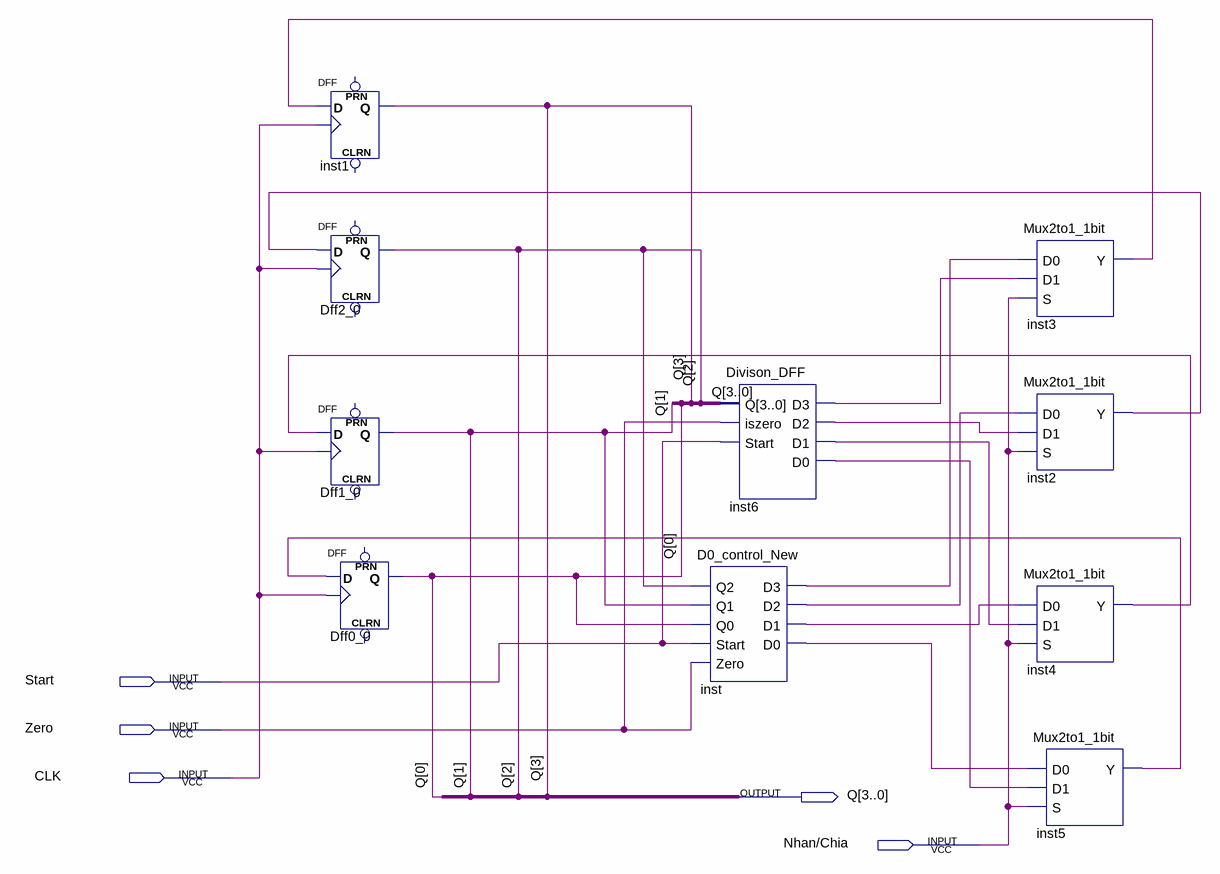
[diagram p0: schematic sheet]
// Quartus schematic Start_Zero_New.bdf as structural Verilog: 10 symbols, 5 pins
module Start_Zero_New (
  input  Start,
  input  Zero,
  input  CLK,
  input  \Nhan/Chia ,
  output [3:0] Q
);

  wire inst2_y, inst3_y, inst4_y, inst5_y, inst6_d0, inst6_d1, inst6_d2, inst6_d3, inst_d0, inst_d1, inst_d2,
       inst_d3;

  DFF inst1 (.CLK(CLK), .D(inst3_y), .Q(Q[3]));  // open: CLRN, PRN
  DFF Dff2_0 (.CLK(CLK), .D(inst2_y), .Q(Q[2]));  // open: CLRN, PRN
  DFF Dff1_0 (.CLK(CLK), .D(inst4_y), .Q(Q[1]));  // open: CLRN, PRN
  DFF Dff0_0 (.CLK(CLK), .D(inst5_y), .Q(Q[0]));  // open: CLRN, PRN
  Divison_DFF inst6 (.Q(Q), .iszero(Zero), .Start(Start), .D3(inst6_d3), .D2(inst6_d2), .D1(inst6_d1), .D0(inst6_d0));
  D0_control_New inst (
    .Q2(Q[2]), .Q1(Q[1]), .Q0(Q[0]), .Start(Start), .Zero(Zero), .D3(inst_d3), .D2(inst_d2), .D1(inst_d1),
    .D0(inst_d0));
  Mux2to1_1bit inst3 (.D0(inst_d3), .D1(inst6_d3), .S(\Nhan/Chia ), .Y(inst3_y));
  Mux2to1_1bit inst2 (.D0(inst_d2), .D1(inst6_d2), .S(\Nhan/Chia ), .Y(inst2_y));
  Mux2to1_1bit inst4 (.D0(inst_d1), .D1(inst6_d1), .S(\Nhan/Chia ), .Y(inst4_y));
  Mux2to1_1bit inst5 (.D0(inst_d0), .D1(inst6_d0), .S(\Nhan/Chia ), .Y(inst5_y));
endmodule
